# EAGLE design segger_adaptor_v1 (EAGLE 6.5.0)
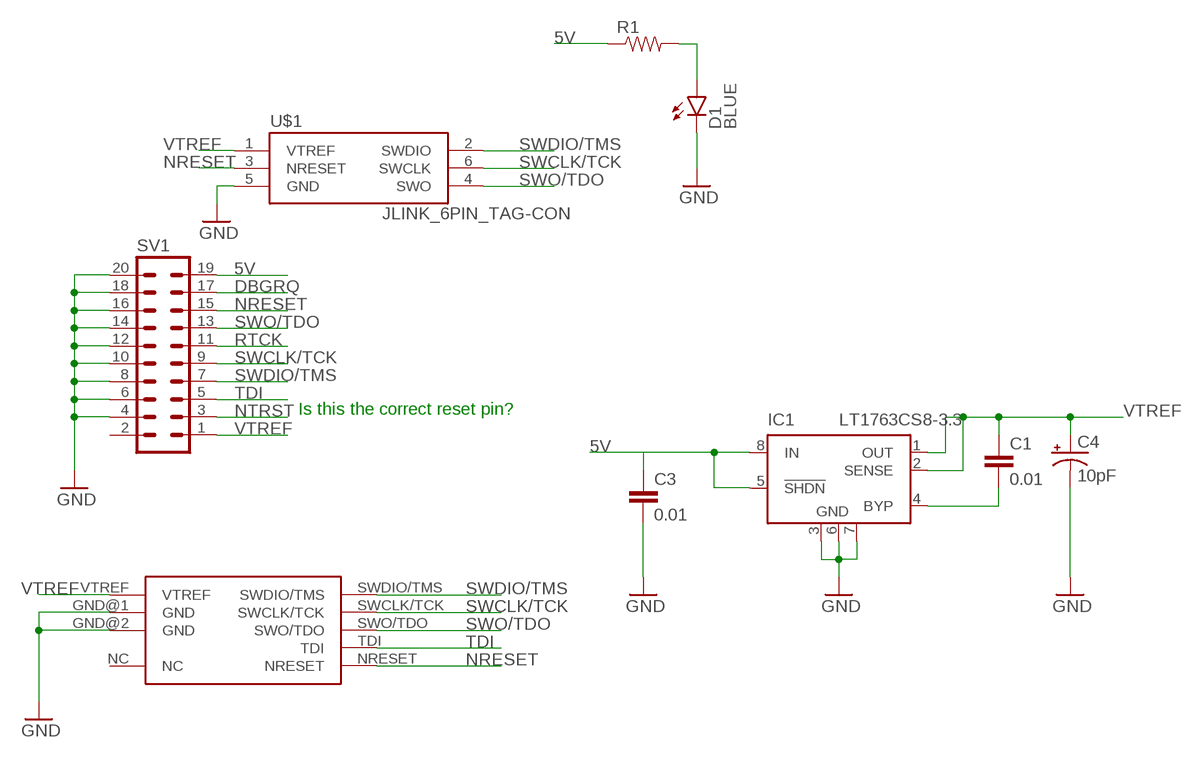
[diagram p0: schematic, sheet 1]

## Parts
C1  0.01  C-EUC0603  [C0603]
C3  0.01  C-EUC0603  [C0603]
C4  10pF  CAP_POL1206  [EIA3216]
D1  BLUE  LED-BLUE0603  [LED-0603]
IC1  LT1763CS8-3.3  [SOIC8]
R1  RESISTOR0402-RES  [0402-RES]
SV1  ML20  [ML20]
U$1  JLINK_6PIN_TAG-CON  [2X3_MALE_SHROUDED_0.100]
U$2  PINHD-2X3/0.050  [2X10-0.050]

## Nets
5V: C3.1 IC1.5(!SHDN) IC1.8(IN) R1.1 SV1.19
DBGRQ: SV1.17
GND: C3.2 C4.C(-) D1.C IC1.3(GND) IC1.6(GND) IC1.7(GND) SV1.4 SV1.6 SV1.8 SV1.10 SV1.12 SV1.14 SV1.16 SV1.18 SV1.20 U$1.5(GND) U$2.GND@1(GND) U$2.GND@2(GND)
N$3: D1.A R1.2
N$4: C1.2 IC1.4(BYP)
NRESET: SV1.15 U$1.3(NRESET) U$2.NRESET
NTRST: SV1.3
RTCK: SV1.11
SWCLK/TCK: SV1.9 U$1.6(SWCLK) U$2.SWCLK/TCK
SWDIO/TMS: SV1.7 U$1.2(SWDIO) U$2.SWDIO/TMS
SWO/TDO: SV1.13 U$1.4(SWO) U$2.SWO/TDO
TDI: SV1.5 U$2.TDI
VTREF: C1.1 C4.A(+) IC1.1(OUT) IC1.2(SENSE) SV1.1 U$1.1(VTREF) U$2.VTREF
Unconnected: SV1.2 U$2.NC

## Notes on the sheet
- Is this the correct reset pin?

## Library data of the parts
C1 C3 = resistor:C-EU: CAPACITOR, European symbol
C4 = SparkFun-Passives:CAP_POL: Capacitor Polarized These are standard SMD and PTH capacitors. Normally 10uF, 47uF, and 100uF in electrolytic and tantalum varieties. Always verify the external diameter of the through hole cap, it varies with capacity, voltage, and manufacturer. The EIA devices should be standard.
D1 = SparkFun-LED:LED-BLUE: Blue LEDs for production use Various blue LEDs stocked by SparkFun production 0603 - DIO-08575 Rebel - DIO-09553 1206 - DIO-09911; PROD_ID: DIO-08575
IC1 = linear-technology:LT1763CS8: 500mA, Low Noise, LDO Micropower Regulators Source: http://cds.linear.com/docs/Datasheet/1763ff.pdf; MPN: LT1763CS8-3.3; OC_FARNELL: 1273617; OC_NEWARK: 57M6055
R1 = SparkFun-Passives:RESISTOR: Resistor Basic schematic elements and footprints for 0603, 1206, and PTH resistors.
SV1 = con-ml:ML20: HARTING; OC_FARNELL: unknown; OC_NEWARK: unknown
U$1 = headers:JLINK_6PIN_TAG-CON: This is a 6-pin Tag Connect header with the J-Link.
U$2 = headers:PINHD-2X3/0.050

## Board
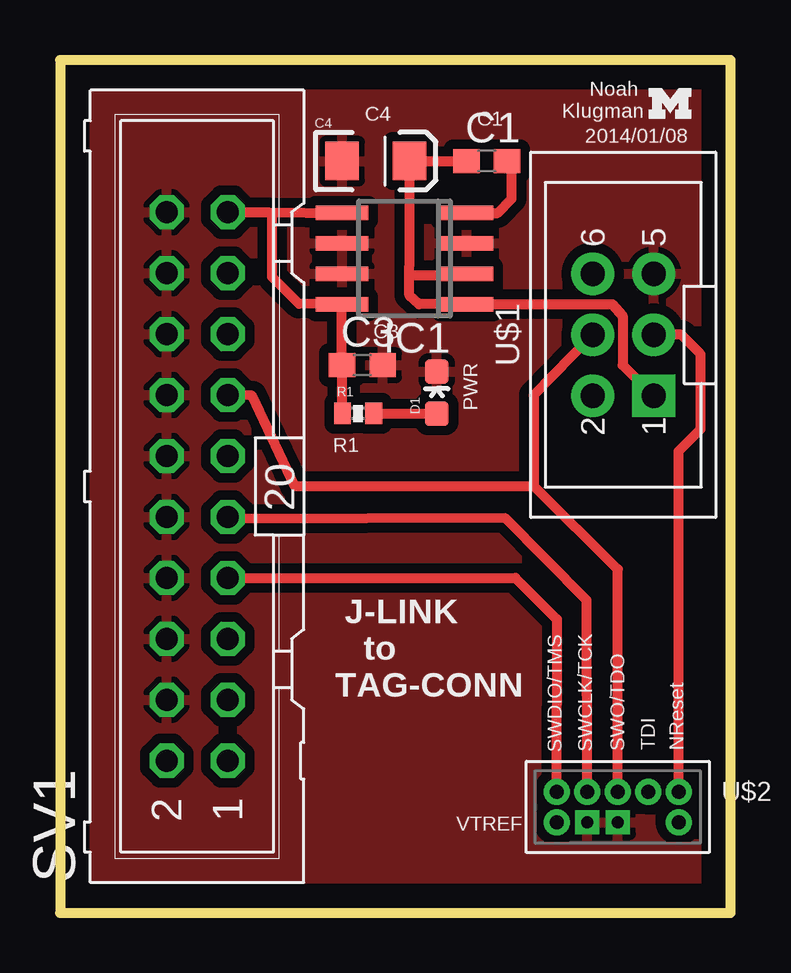
[diagram p1: board, top side]
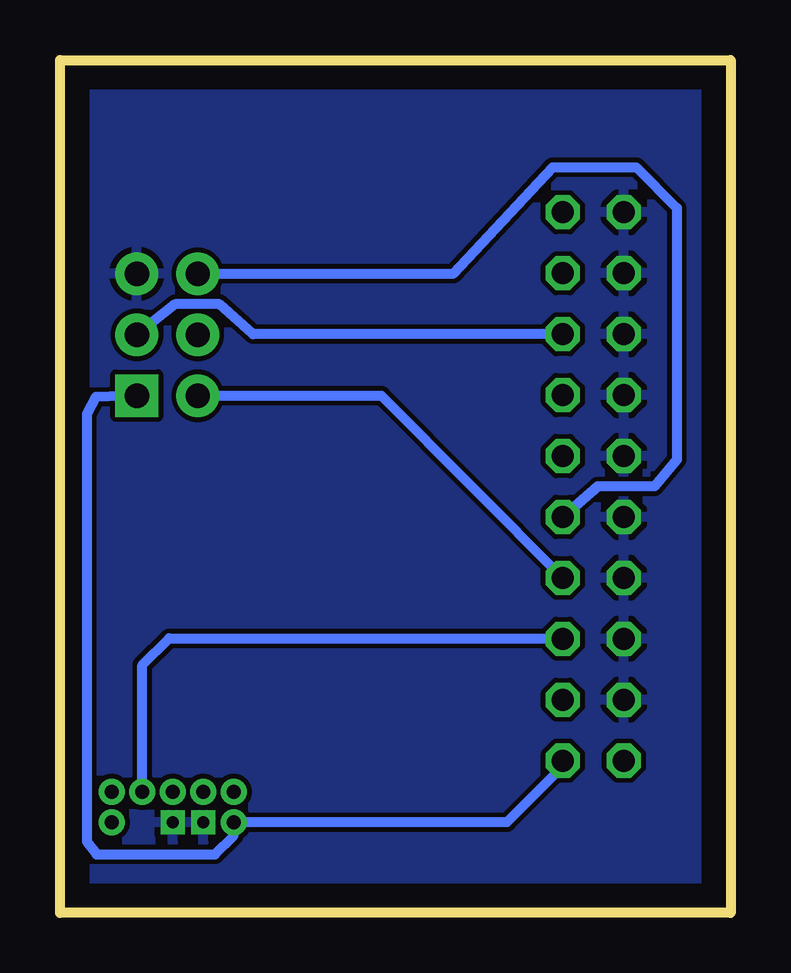
[diagram p2: board, bottom side, seen from below]

Size 27.94 x 35.56 mm. Coordinates in mm from the lower left corner, seen from the top.
Outline: 0,35.56 0,0 27.94,0 27.94,35.56 0,35.56
Copper layers (1*16): Top 0.035mm / dielectric 1.5mm / Bottom 0.035mm
Design rules "default": minimum track width 10mil, minimum drill 24mil, track to track 8mil, track to pad 8mil, pad to pad 8mil, via to via 8mil, smd to smd 8mil, copper to edge 40mil, drill to drill 8mil, minimum pad ring 10mil, minimum via ring 8mil, stop-mask expansion 4mil, vias tented up to drill 0mil, thermal gap 10mil

### Footprints (pad centres in the part's own frame; a part is rotated, then mirrored left to right if it is on the bottom)
C0603 = smd 1.1 x 1: 1 -0.85,0; 2 0.85,0
EIA3216 = smd 1.4 x 1.6: A 1.4,0; C -1.4,0
LED-0603 = smd 1 x 1: A 0,-0.877; C 0,0.877
SOIC8 = smd 0.6 x 2.2: 1 -1.905,-2.6; 2 -0.635,-2.6; 3 0.635,-2.6; 4 1.905,-2.6; 5 1.905,2.6; 6 0.635,2.6; 7 -0.635,2.6; 8 -1.905,2.6
0402-RES = smd 0.7 x 0.9: 1 -0.65,0; 2 0.65,0
ML20 = drill 0.914 octagon: 1 -11.43,-1.27; 2 -11.43,1.27; 3 -8.89,-1.27; 4 -8.89,1.27; 5 -6.35,-1.27; 6 -6.35,1.27; 7 -3.81,-1.27; 8 -3.81,1.27; 9 -1.27,-1.27; 10 -1.27,1.27; 11 1.27,-1.27; 12 1.27,1.27; 13 3.81,-1.27; 14 3.81,1.27; 15 6.35,-1.27; 16 6.35,1.27; 17 8.89,-1.27; 18 8.89,1.27; 19 11.43,-1.27; 20 11.43,1.27
2X3_MALE_SHROUDED_0.100 = drill 1.016 pad 1.778 square: 1 -2.54,-1.27 | drill 1.016 pad 1.778: 2 -2.54,1.27; 3 0,-1.27; 4 0,1.27; 5 2.54,-1.27; 6 2.54,1.27
2X10-0.050 = drill 0.5 square: GND@1 -2.54,0; GND@2 -1.27,0 | drill 0.584: NC 1.27,0; NRESET 1.27,1.27; SWCLK/TCK -2.54,1.27; SWDIO/TMS -3.81,1.27; SWO/TDO -1.27,1.27; TDI 0,1.27; VTREF -3.81,0

### Placement (x,y rotation side)
C1  17.78,31.34 0 top
C3  12.6,22.83 0 top
C4  13.16,31.34 0 top
D1  15.7,21.69 0 top
IC1  14.35,27.28 90 top
R1  12.42,20.83 0 top
SV1  5.71,17.78 90 top
U$1  23.47,24.1 90 top
U$2  24.51,3.78 0 top
U$3  [UMICH_SOLID_50MIL]  25.43,33.76 0 top

### Tracks (layer width: path | path; a pad name or v marks a point on that pad's centre or on a via)
5V
  Top 0.406: SV1.19 8.69,29.21 | 8.69,29.21 IC1.5 11.76,29.22 | 8.69,29.21 8.84,29.06 8.84,26.52 9.96,25.4 IC1.8 11.75,25.4 C3.1 11.77,22.84 R1.1
GND
  pour Top (isolate 0.406): -2.54,-1.27 33.02,-1.27 33.02,39.37 -2.54,40.64
  pour Bottom: -1.27,36.83 30.48,36.83 30.48,-7.62 -1.27,-7.62
N$3
  Top 0.406: R1.2 15.68,20.83 D1.A
N$4
  Top 0.406: IC1.4 18.24,29.18 18.82,29.77 18.82,31.15 C1.2
NRESET
  Top 0.406: U$2.NRESET 25.78,19.25 26.7,20.17 26.7,23.29 25.88,24.11 U$1.3
  Bottom 0.406: U$1.3 23.14,25.38 21.29,25.38 19.91,24.16 19.89,24.13 SV1.15
SWCLK/TCK
  Top 0.406: U$2.SWCLK/TCK 21.95,13.03 18.54,16.46 7.06,16.43 SV1.9 7.19,16.43
  Bottom 0.406: U$1.6 11.56,26.64 7.42,31.09 3.94,31.09 2.23,29.39 2.23,18.9 3.18,17.78 5.54,17.78 SV1.9
SWDIO/TMS
  Top 0.406: SV1.7 18.97,13.97 20.7,12.24 20.68,5.08 U$2.SWDIO/TMS
  Bottom 0.406: U$1.2 14.55,21.56 SV1.7
SWO/TDO
  Top 0.406: U$1.4 19.74,21.59 19.74,17.8 | 19.74,17.8 23.24,14.33 U$2.SWO/TDO | 19.74,17.8 9.78,17.8 8,21.56 SV1.13
TDI
  Bottom 0.406: U$2.TDI 24.51,10.34 23.39,11.46 7.01,11.46 SV1.5
VTREF
  Top 0.406: U$1.1 23.44,22.84 23.44,24.89 23.01,25.38 IC1.1 14.96,25.38 14.55,25.76 14.55,26.67 | IC1.2 16.93,26.59 14.63,26.59 14.55,26.67 | 14.55,26.67 14.55,26.99 14.56,27 C4.A C1.1
  Bottom 0.406: U$1.1 26.44,21.51 26.82,20.8 26.82,2.97 26.42,2.44 21.49,2.44 20.7,3.23 U$2.VTREF 9.32,3.79 6.98,6.12 SV1.1

### Text on the board
tPlace: Noah / Klugman | C4 | C1 | 2014/01/08 | C3 | PWR | R1 | J-LINK / to / TAG-CONN | SWDIO/TMS | SWCLK/TCK | SWO/TDO | TDI | NReset | VTREF